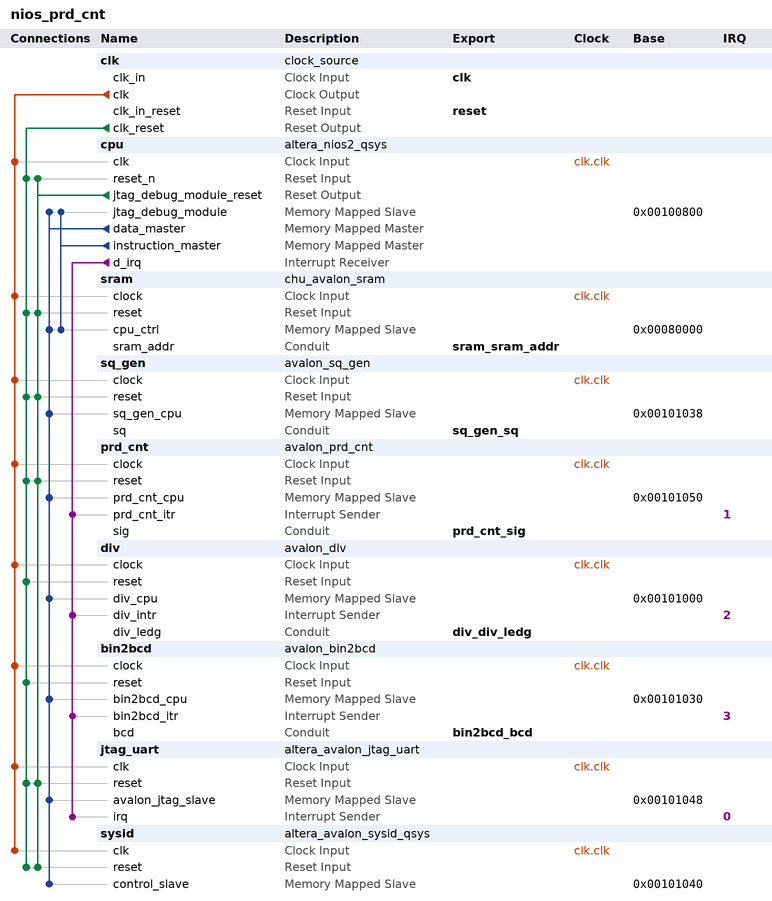
[diagram p0: system contents]
# Platform Designer (Qsys) system nios_prd_cnt, Cyclone IV GX Unknown
# Parameters at their usual value, and those the tool derives, are not listed.
package require -exact qsys 13.0
create_system nios_prd_cnt
set_project_property DEVICE_FAMILY {Cyclone IV GX}
set_project_property DEVICE Unknown

add_instance clk clock_source 13.0
set_instance_parameter_value clk clockFrequency 50000000

add_instance cpu altera_nios2_qsys 13.0
set_instance_parameter_value cpu resetSlave sram.cpu_ctrl
set_instance_parameter_value cpu mmu_TLBMissExcSlave None
set_instance_parameter_value cpu exceptionSlave sram.cpu_ctrl
set_instance_parameter_value cpu breakSlave cpu.jtag_debug_module
set_instance_parameter_value cpu impl Tiny
set_instance_parameter_value cpu icache_size 4096

add_instance sram chu_avalon_sram 1.0

add_instance sq_gen avalon_sq_gen 1.0
set_instance_parameter_value sq_gen MAX_PER 50000000

add_instance prd_cnt avalon_prd_cnt 1.0

add_instance div avalon_div 1.0
set_instance_parameter_value div W 32

add_instance bin2bcd avalon_bin2bcd 1.0

add_instance jtag_uart altera_avalon_jtag_uart 13.0.1.99.2
set_instance_parameter_value jtag_uart simInteractiveOptions NO_INTERACTIVE_WINDOWS

add_instance sysid altera_avalon_sysid_qsys 13.0
set_instance_parameter_value sysid id 0

# connections
add_connection clk.clk bin2bcd.clock clock
add_connection clk.clk cpu.clk clock
add_connection clk.clk div.clock clock
add_connection clk.clk jtag_uart.clk clock
add_connection clk.clk prd_cnt.clock clock
add_connection clk.clk sq_gen.clock clock
add_connection clk.clk sram.clock clock
add_connection clk.clk sysid.clk clock
add_connection clk.clk_reset bin2bcd.reset reset
add_connection clk.clk_reset cpu.reset_n reset
add_connection clk.clk_reset div.reset reset
add_connection clk.clk_reset jtag_uart.reset reset
add_connection clk.clk_reset prd_cnt.reset reset
add_connection clk.clk_reset sq_gen.reset reset
add_connection clk.clk_reset sram.reset reset
add_connection clk.clk_reset sysid.reset reset
add_connection cpu.jtag_debug_module_reset cpu.reset_n reset
add_connection cpu.jtag_debug_module_reset jtag_uart.reset reset
add_connection cpu.jtag_debug_module_reset prd_cnt.reset reset
add_connection cpu.jtag_debug_module_reset sq_gen.reset reset
add_connection cpu.jtag_debug_module_reset sram.reset reset
add_connection cpu.jtag_debug_module_reset sysid.reset reset
add_connection cpu.data_master bin2bcd.bin2bcd_cpu avalon
set_connection_parameter_value cpu.data_master/bin2bcd.bin2bcd_cpu baseAddress 0x00101030
add_connection cpu.data_master cpu.jtag_debug_module avalon
set_connection_parameter_value cpu.data_master/cpu.jtag_debug_module baseAddress 0x00100800
add_connection cpu.data_master div.div_cpu avalon
set_connection_parameter_value cpu.data_master/div.div_cpu baseAddress 0x00101000
add_connection cpu.data_master jtag_uart.avalon_jtag_slave avalon
set_connection_parameter_value cpu.data_master/jtag_uart.avalon_jtag_slave baseAddress 0x00101048
add_connection cpu.data_master prd_cnt.prd_cnt_cpu avalon
set_connection_parameter_value cpu.data_master/prd_cnt.prd_cnt_cpu baseAddress 0x00101050
add_connection cpu.data_master sq_gen.sq_gen_cpu avalon
set_connection_parameter_value cpu.data_master/sq_gen.sq_gen_cpu baseAddress 0x00101038
add_connection cpu.data_master sram.cpu_ctrl avalon
set_connection_parameter_value cpu.data_master/sram.cpu_ctrl baseAddress 0x00080000
add_connection cpu.data_master sysid.control_slave avalon
set_connection_parameter_value cpu.data_master/sysid.control_slave baseAddress 0x00101040
add_connection cpu.instruction_master cpu.jtag_debug_module avalon
set_connection_parameter_value cpu.instruction_master/cpu.jtag_debug_module baseAddress 0x00100800
add_connection cpu.instruction_master sram.cpu_ctrl avalon
set_connection_parameter_value cpu.instruction_master/sram.cpu_ctrl baseAddress 0x00080000
add_connection cpu.d_irq bin2bcd.bin2bcd_itr interrupt
set_connection_parameter_value cpu.d_irq/bin2bcd.bin2bcd_itr irqNumber 3
add_connection cpu.d_irq div.div_intr interrupt
set_connection_parameter_value cpu.d_irq/div.div_intr irqNumber 2
add_connection cpu.d_irq jtag_uart.irq interrupt
set_connection_parameter_value cpu.d_irq/jtag_uart.irq irqNumber 0
add_connection cpu.d_irq prd_cnt.prd_cnt_itr interrupt
set_connection_parameter_value cpu.d_irq/prd_cnt.prd_cnt_itr irqNumber 1

# exported interfaces
add_interface clk clock sink
set_interface_property clk EXPORT_OF clk.clk_in
add_interface reset reset sink
set_interface_property reset EXPORT_OF clk.clk_in_reset
add_interface sram_sram_addr conduit end
set_interface_property sram_sram_addr EXPORT_OF sram.sram_addr
add_interface sq_gen_sq conduit end
set_interface_property sq_gen_sq EXPORT_OF sq_gen.sq
add_interface prd_cnt_sig conduit end
set_interface_property prd_cnt_sig EXPORT_OF prd_cnt.sig
add_interface bin2bcd_bcd conduit end
set_interface_property bin2bcd_bcd EXPORT_OF bin2bcd.bcd
add_interface div_div_ledg conduit end
set_interface_property div_div_ledg EXPORT_OF div.div_ledg

set_interconnect_requirement {$system} qsys_mm.clockCrossingAdapter HANDSHAKE
set_interconnect_requirement {$system} qsys_mm.maxAdditionalLatency 1

save_system nios_prd_cnt.qsys
